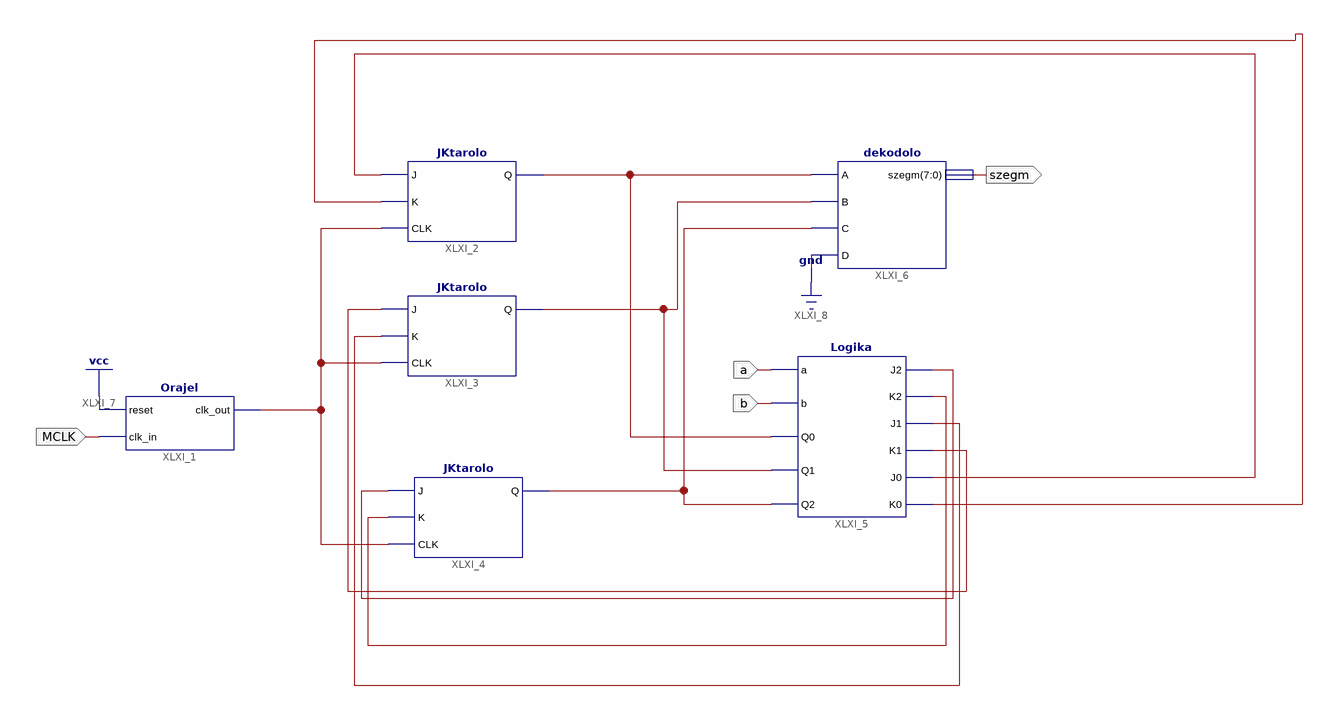
[diagram p0: schematic sheet 1]
// Xilinx ISE schematic Frek.sch (spartan3e) as structural Verilog: 6 symbols, 4 ports
module Frek (
  input  MCLK,
  input  a,
  input  b,
  output szegm
);

  wire XLXN_9, XLXN_11, XLXN_12, XLXN_13, XLXN_19, XLXN_20, XLXN_21, XLXN_22, XLXN_23, XLXN_24;

  Orajel XLXI_1 (.reset(1'b1), .clk_in(MCLK), .clk_out(XLXN_9));
  JKtarolo XLXI_2 (.J(XLXN_19), .K(XLXN_20), .CLK(XLXN_9), .Q(XLXN_13));
  JKtarolo XLXI_3 (.J(XLXN_21), .K(XLXN_22), .CLK(XLXN_9), .Q(XLXN_11));
  JKtarolo XLXI_4 (.J(XLXN_23), .K(XLXN_24), .CLK(XLXN_9), .Q(XLXN_12));
  Logika XLXI_5 (
    .a(a), .b(b), .Q0(XLXN_13), .Q1(XLXN_11), .Q2(XLXN_12), .J2(XLXN_23), .K2(XLXN_24), .J1(XLXN_22),
    .K1(XLXN_21), .J0(XLXN_19), .K0(XLXN_20));
  dekodolo XLXI_6 (.A(XLXN_13), .B(XLXN_11), .C(XLXN_12), .D(1'b0), .szegm({8{szegm}}));
endmodule
